# Altium schematic sheet [01] - COVER PAGE.SchDoc: DWM1003
size A3; DrawnBy: Ing. Jiri Kubias; DocumentNumber: 1; Revision: v2; SheetNumber: 1; SheetTotal: 7; SheetFunction: Index page
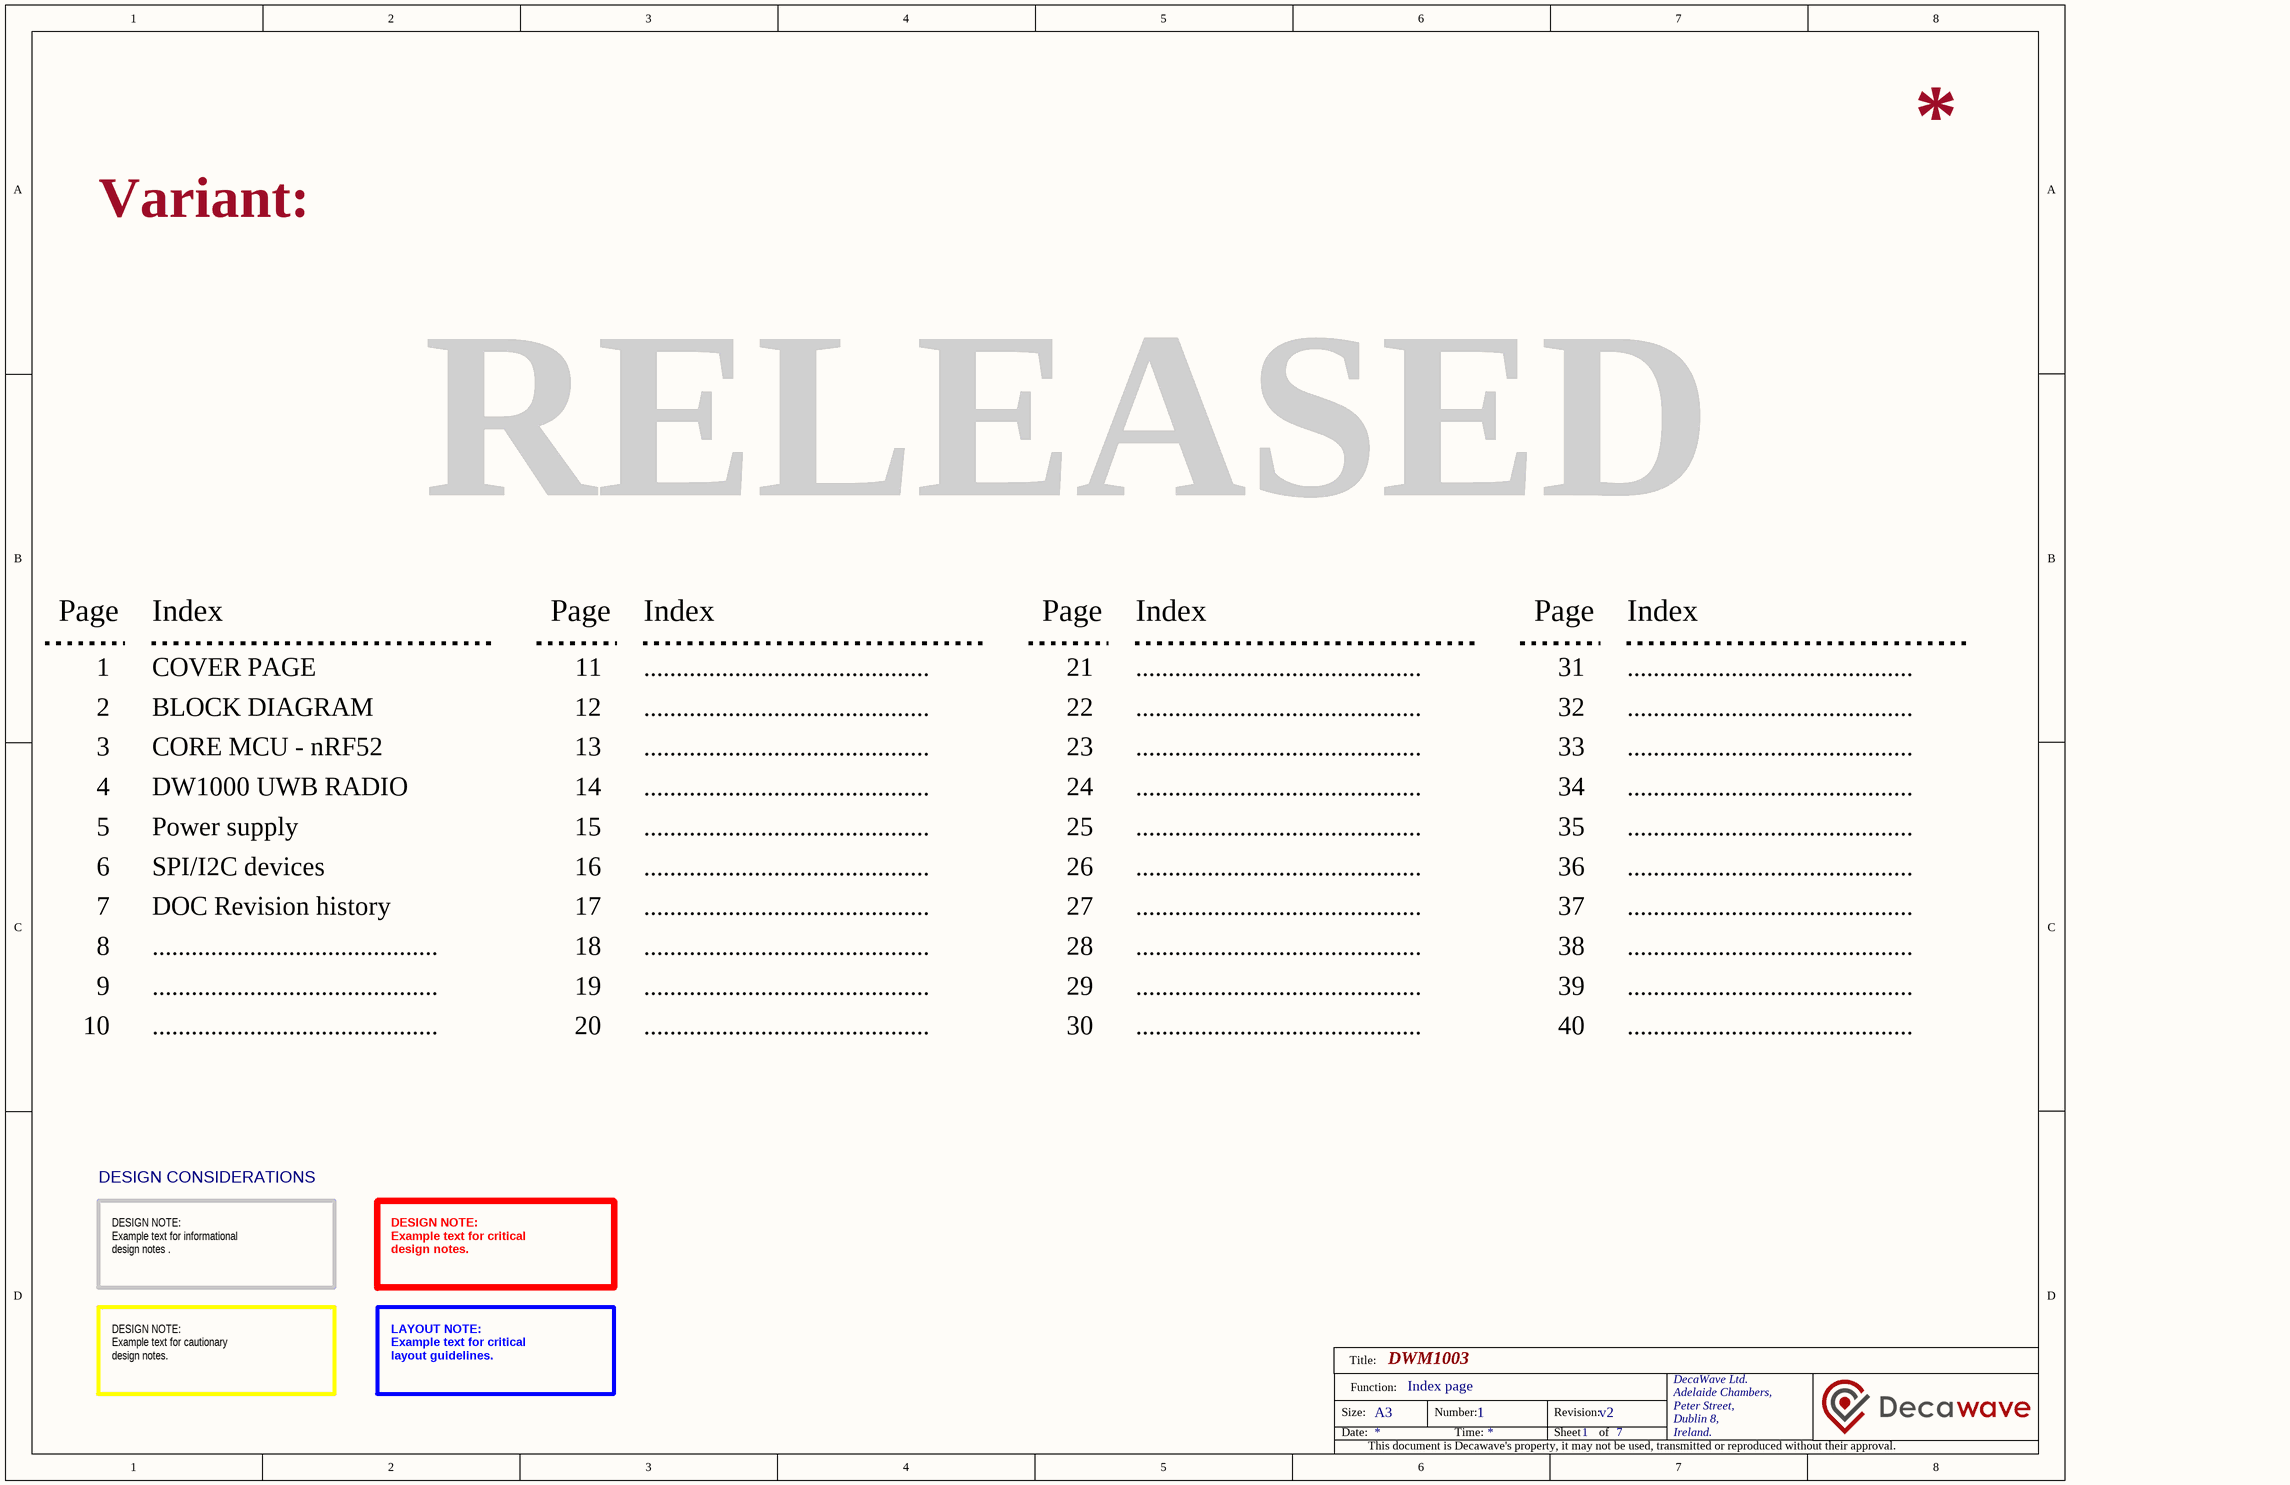
[diagram p0: [01] - COVER PAGE.SchDoc]

## Notes on the sheet
- Variant:
- RELEASED
- Page
- Index
- 1
- COVER PAGE
- 11
- ............................................
- 21
- 31
- 2
- 3
- BLOCK DIAGRAM
- CORE MCU - nRF52
- 12
- 13
- 22
- 23
- 32
- 33
- 4
- 5
- DW1000 UWB RADIO
- Power supply
- 14
- 15
- 24
- 25
- 34
- 35
- 6
- SPI/I2C devices
- 16
- 26
- 36
- 7
- 8
- DOC Revision history
- 17
- 18
- 27
- 28
- 37
- 38
- 9
- 10
- 19
- 20
- 29
- 30
- 39
- 40
- DESIGN CONSIDERATIONS
- DESIGN NOTE:
  Example text for informational
  design notes .
- DESIGN NOTE:
  Example text for critical
  design notes.
- DESIGN NOTE:
  Example text for cautionary
  design notes.
- LAYOUT NOTE:
  Example text for critical
  layout guidelines.
- Title:
- Size:
- Date:
- Function:
- A3
- Number:
- Time:
- Revision:
- Sheet
- of
- DecaWave Ltd.
- Adelaide Chambers,
- Peter Street,
- Dublin 8,
- Ireland.
- This document is Decawave's property, it may not be used, transmitted or reproduced without their approval.